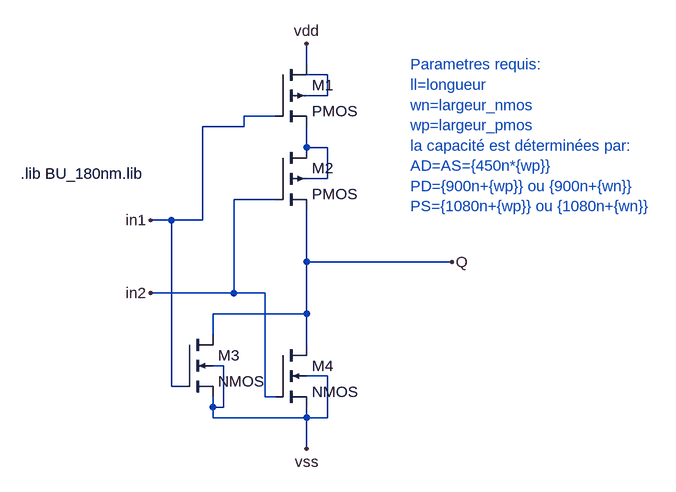
[diagram p0: schematic nor.asc]
nor.asc, the LTspice schematic file:
Version 4
SHEET 1 1192 868
WIRE 416 192 416 160
WIRE 448 208 416 208
WIRE 448 240 448 208
WIRE 448 240 416 240
WIRE 368 272 320 272
WIRE 320 288 320 272
WIRE 320 288 256 288
WIRE 416 320 416 288
WIRE 448 320 416 320
WIRE 448 368 448 320
WIRE 448 368 416 368
WIRE 368 400 304 400
WIRE 208 432 176 432
WIRE 256 432 256 288
WIRE 256 432 208 432
WIRE 416 496 416 416
WIRE 640 496 416 496
WIRE 304 544 304 400
WIRE 304 544 176 544
WIRE 352 544 304 544
WIRE 416 576 416 496
WIRE 416 576 272 576
WIRE 272 608 272 576
WIRE 416 624 416 576
WIRE 288 656 272 656
WIRE 448 672 416 672
WIRE 208 688 208 432
WIRE 224 688 208 688
WIRE 352 704 352 544
WIRE 368 704 352 704
WIRE 272 720 272 704
WIRE 288 720 288 656
WIRE 288 720 272 720
WIRE 272 736 272 720
WIRE 416 736 416 720
WIRE 416 736 272 736
WIRE 448 736 448 672
WIRE 448 736 416 736
WIRE 416 784 416 736
FLAG 416 160 vdd
FLAG 416 784 vss
FLAG 640 496 Q
FLAG 176 432 in1
FLAG 176 544 in2
SYMBOL pmos4 368 192 R0
SYMATTR InstName M1
SYMATTR Value2 l={ll} w={wp} ad={450n*{wp}} as={450n*{wp}} pd={900n+{wp}} ps={1080n+{wp}}
SYMBOL pmos4 368 320 R0
SYMATTR InstName M2
SYMATTR Value2 l={ll} w={wp} ad={450n*{wp}} as={450n*{wp}} pd={900n+{wp}} ps={1080n+{wp}}
SYMBOL nmos4 224 608 R0
SYMATTR InstName M3
SYMATTR Value2 l={ll} w={wn} ad={450n*{wn}} as={450n*{wn}} pd={900n+{wn}} ps={1080n+{wn}}
SYMBOL nmos4 368 624 R0
SYMATTR InstName M4
SYMATTR Value2 l={ll} w={wn} ad={450n*{wn}} as={450n*{wn}} pd={900n+{wn}} ps={1080n+{wn}}
TEXT -24 360 Left 2 !.lib BU_180nm.lib
TEXT 576 192 Left 2 ;Parametres requis: \nll=longueur \nwn=largeur_nmos \nwp=largeur_pmos\nla capacité est déterminées par:     \nAD=AS={450n*{wp}}\nPD={900n+{wp}} ou {900n+{wn}}\nPS={1080n+{wp}} ou {1080n+{wn}}

The netlist it stands for:
* nor.asc
M1 vdd in1 N002 N001 PMOS l={ll} w={wp} ad={450n*{wp}} as={450n*{wp}} pd={900n+{wp}} ps={1080n+{wp}}
M2 N002 in2 Q N002 PMOS l={ll} w={wp} ad={450n*{wp}} as={450n*{wp}} pd={900n+{wp}} ps={1080n+{wp}}
M3 Q in1 vss vss NMOS l={ll} w={wn} ad={450n*{wn}} as={450n*{wn}} pd={900n+{wn}} ps={1080n+{wn}}
M4 Q in2 vss vss NMOS l={ll} w={wn} ad={450n*{wn}} as={450n*{wn}} pd={900n+{wn}} ps={1080n+{wn}}
.model NMOS NMOS
.model PMOS PMOS
.lib standard.mos
.lib BU_180nm.lib
* Parametres requis:
* ll=longueur
* wn=largeur_nmos
* wp=largeur_pmos
* la capacité est déterminées par:
* AD=AS={450n*{wp}}
* PD={900n+{wp}} ou {900n+{wn}}
* PS={1080n+{wp}} ou {1080n+{wn}}
.backanno
.end